# Altium project uAMDC.PrjPcb (part 3 of 3)
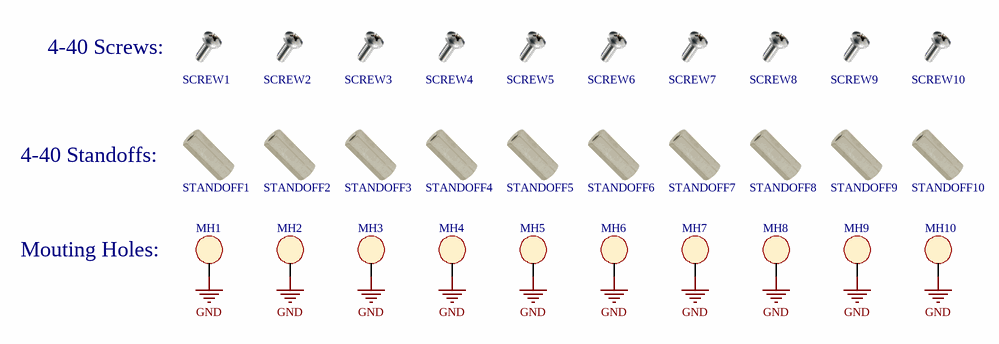
[diagram p26: BackPage.SchDoc]

## Nets that join several sheets
1.8V: USB_UART (6 pins), FPGA (10 pins), InverterTranslation (JP2.3 JP3.3 JP4.3 JP5.3), U_FPGA/U_DriveInterface/U_InverterTranslation/U_LVHV8ChanTranslation4 (C4A.2 U2A.1 U2A.2), U_FPGA/U_DriveInterface/U_InverterTranslation/U_LVHV8ChanTranslation5 (C4B.2 U2B.1 U2B.2), U_FPGA/U_DriveInterface/U_InverterTranslation/U_LVHV8ChanTranslation6 (C4C.2 U2C.1 U2C.2), U_FPGA/U_DriveInterface/U_InverterTranslation/U_TranslationStsA (C8C.1 U4C.1), U_FPGA/U_DriveInterface/U_InverterTranslation/U_TranslationStsB (C8D.1 U4D.1), U_FPGA/U_DriveInterface/U_InverterTranslation/U_TranslationStsC (C8E.1 U4E.1), U_FPGA/U_DriveInterface/U_InverterTranslation/U_TranslationStsD (C8F.1 U4F.1), AnalogADCs (R18.1), Encoder (C12.1 U6.23 U6.24), FPGA_IO (C106.1 U24.1 U24.5), Power (R75.1)
3.3V: DSP (33 pins), U_DSP/U_GPIO/isoSPI1_Interface (C96A.2 R47A.2 U20A.1 U20A.6), U_DSP/U_GPIO/U_TranslationSPI_A (C8A.1 U4A.1), U_DSP/U_GPIO/U_TranslationSPI_C (C8B.1 U4B.1 U4B.2), U_DSP/U_GPIO/isoSPI2_Interface (C96B.2 R47B.2 U20B.1 U20B.6), U_DSP/U_GPIO/isoSPI3_Interface (C96C.2 R47C.2 U20C.1 U20C.6), U_DSP/U_GPIO/isoSPI4_Interface (C96D.2 R47D.2 U20D.1 U20D.6), SWD (J1.1), Ethernet (8 pins), FPGA (10 pins), DriveInterface (JP1.1), FPGA_IO (R57.1 R58.1), Power (R74.1)
5.5V: Power (11 pins), Power_InrushLimit (U39.7 U39.8)
5V: GPIO (6 pins), U_DSP/U_GPIO/isoSPI1_Interface (C97A.2 U20A.9 U20A.12), U_DSP/U_GPIO/U_TranslationSPI_A (C7A.1 U4A.23 U4A.24), U_DSP/U_GPIO/U_TranslationSPI_C (C7B.1 U4B.23 U4B.24), U_DSP/U_GPIO/isoSPI2_Interface (C97B.2 U20B.9 U20B.12), U_DSP/U_GPIO/isoSPI3_Interface (C97C.2 U20C.9 U20C.12), U_DSP/U_GPIO/isoSPI4_Interface (C97D.2 U20D.9 U20D.12), USB_UART (U22.5), USB (U41.5), DriveInterface (JP1.3), U_FPGA/U_DriveInterface/U_InverterTranslation/U_LVHV8ChanTranslation4 (C1A.1 U2A.23 U2A.24), U_FPGA/U_DriveInterface/U_InverterTranslation/U_LVHV8ChanTranslation5 (C1B.1 U2B.23 U2B.24), U_FPGA/U_DriveInterface/U_InverterTranslation/U_LVHV8ChanTranslation6 (C1C.1 U2C.23 U2C.24), AnalogInterface (U13.1), AnalogADCs (R17.1), Encoder (9 pins), FPGA_IO (15 pins), Power (R66.1)
+12V: AnalogConnectors (CON5.3A CON5.3B CON5.3C CON5.3D), AnalogConditioning (R19.1 R22.1), Power (R73.1)
-12V: AnalogConnectors (CON5.5A CON5.5B CON5.5C CON5.5D), AnalogConditioning (R20.1 R23.1), Power (R77.1)
GND: DSP (33 pins), GPIO (11 pins), U_DSP/U_GPIO/isoSPI1_Interface (7 pins), U_DSP/U_GPIO/U_TranslationSPI_A (11 pins), U_DSP/U_GPIO/U_TranslationSPI_C (10 pins), U_DSP/U_GPIO/isoSPI2_Interface (7 pins), U_DSP/U_GPIO/isoSPI3_Interface (7 pins), U_DSP/U_GPIO/isoSPI4_Interface (7 pins), USB_UART (11 pins), SWD (J1.3 J1.5 J1.9), USB (6 pins), Ethernet (22 pins), FPGA (21 pins), DriveInterface (CON2.2), U_FPGA/U_DriveInterface/U_InverterConnectors/InverterConnector1AB (5 pins), U_FPGA/U_DriveInterface/U_InverterConnectors/InverterConnector2AB (5 pins), InverterTranslation (JP2.1 JP3.1 JP4.1 JP5.1), U_FPGA/U_DriveInterface/U_InverterTranslation/U_LVHV8ChanTranslation4 (14 pins), U_FPGA/U_DriveInterface/U_InverterTranslation/U_LVHV8ChanTranslation5 (14 pins), U_FPGA/U_DriveInterface/U_InverterTranslation/U_LVHV8ChanTranslation6 (14 pins), U_FPGA/U_DriveInterface/U_InverterTranslation/U_TranslationStsA (6 pins), U_FPGA/U_DriveInterface/U_InverterTranslation/U_TranslationStsB (6 pins), U_FPGA/U_DriveInterface/U_InverterTranslation/U_TranslationStsC (6 pins), U_FPGA/U_DriveInterface/U_InverterTranslation/U_TranslationStsD (6 pins), AnalogInterface (U13.3), AnalogADCs (37 pins), AnalogConnectors (25 pins), U_FPGA/U_AnalogInterface/U_AnalogConditioning/AnalogSigCond_A (8 pins), U_FPGA/U_AnalogInterface/U_AnalogConditioning/AnalogSigCond_B (8 pins), Encoder (21 pins), FPGA_IO (19 pins), Power (24 pins), Power_InrushLimit (C140.1 C141.1 U39.5 U39.9), BackPage (10 pins)
GND_IN: Power (C112.1 CON10.2 L2.2), Power_Protection (C142.2 C143.2 R82.2 U40.4)
GND_IN_PS: DriveInterface (CON1.2), U_FPGA/U_DriveInterface/U_InverterConnectors/InverterConnector1AB (CON3A.14A CON3A.14B), U_FPGA/U_DriveInterface/U_InverterConnectors/InverterConnector2AB (CON3B.14A CON3B.14B)
VDRIVE: DriveInterface (CON2.1), U_FPGA/U_DriveInterface/U_InverterTranslation/U_LVHV8ChanTranslation4 (8 pins), U_FPGA/U_DriveInterface/U_InverterTranslation/U_LVHV8ChanTranslation5 (8 pins), U_FPGA/U_DriveInterface/U_InverterTranslation/U_LVHV8ChanTranslation6 (8 pins)
VIN: Power (CON10.1), Power_Protection (6 pins)
VIN2: GPIO (CON9.6A CON9.6B), Power (7 pins)
VIN_ETH: Ethernet (7 pins), Power (R67.1)
VIN_FPGA: FPGA (11 pins), Power (R76.1)
VIN_PS: DriveInterface (CON1.1), InverterConnectors (R2.2 R4.2 R6.2 R8.2)
5.5VICL: Power (JP10.1), Power_InrushLimit (5 pins)
+12V: AnalogConditioning (R19.2), U_FPGA/U_AnalogInterface/U_AnalogConditioning/AnalogSigCond_A (C37A.2 C41A.2 U14A.11 U15A.11)
+12V: AnalogConditioning (R22.2), U_FPGA/U_AnalogInterface/U_AnalogConditioning/AnalogSigCond_B (C37B.2 C41B.2 U14B.11 U15B.11)
-12V: AnalogConditioning (R20.2), U_FPGA/U_AnalogInterface/U_AnalogConditioning/AnalogSigCond_A (C38A.1 C43A.1 U14A.4 U15A.4)
-12V: AnalogConditioning (R23.2), U_FPGA/U_AnalogInterface/U_AnalogConditioning/AnalogSigCond_B (C38B.1 C43B.1 U14B.4 U15B.4)
ADC_CLKOUT: FPGA (U16.138), AnalogADCs (TP3.1 U8.33)
ADC_CNV: FPGA (U16.144), AnalogADCs (TP1.1 U8.24)
ADC_IN1: AnalogADCs (U8.20), U_FPGA/U_AnalogInterface/U_AnalogConditioning/AnalogSigCond_A (C42A.1 R38A.1)
ADC_IN2: AnalogADCs (U8.17), U_FPGA/U_AnalogInterface/U_AnalogConditioning/AnalogSigCond_A (C40A.1 R37A.1)
ADC_IN3: AnalogADCs (U8.14), U_FPGA/U_AnalogInterface/U_AnalogConditioning/AnalogSigCond_B (C39B.1 R36B.1)
ADC_IN4: AnalogADCs (U8.11), U_FPGA/U_AnalogInterface/U_AnalogConditioning/AnalogSigCond_B (C36B.1 R35B.1)
ADC_IN5: AnalogADCs (U8.5), U_FPGA/U_AnalogInterface/U_AnalogConditioning/AnalogSigCond_B (C40B.1 R37B.1)
ADC_IN6: AnalogADCs (U8.2), U_FPGA/U_AnalogInterface/U_AnalogConditioning/AnalogSigCond_B (C42B.1 R38B.1)
ADC_IN7: AnalogADCs (U8.51), U_FPGA/U_AnalogInterface/U_AnalogConditioning/AnalogSigCond_A (C36A.1 R35A.1)
ADC_IN8: AnalogADCs (U8.48), U_FPGA/U_AnalogInterface/U_AnalogConditioning/AnalogSigCond_A (C39A.1 R36A.1)
ADC_SCK: FPGA (U16.130), AnalogADCs (TP2.1 U8.41)
ADC_SDO1: FPGA (U16.143), AnalogADCs (U8.27)
ADC_SDO2: FPGA (U16.142), AnalogADCs (U8.28)
ADC_SDO3: FPGA (U16.141), AnalogADCs (U8.29)
ADC_SDO4: FPGA (U16.139), AnalogADCs (U8.30)
ADC_SDO5: FPGA (U16.137), AnalogADCs (U8.35)
ADC_SDO6: FPGA (U16.136), AnalogADCs (U8.36)
ADC_SDO7: FPGA (U16.135), AnalogADCs (U8.39)
ADC_SDO8: FPGA (U16.134), AnalogADCs (U8.40)
ANLG_N1: AnalogConnectors (CON5.2A R25.1 U11.3), U_FPGA/U_AnalogInterface/U_AnalogConditioning/AnalogSigCond_A (U15A.10)
ANLG_N2: AnalogConnectors (CON5.8A R26.1 U9.2), U_FPGA/U_AnalogInterface/U_AnalogConditioning/AnalogSigCond_A (U15A.12)
ANLG_N3: AnalogConnectors (CON5.2B R27.1 U10.1), U_FPGA/U_AnalogInterface/U_AnalogConditioning/AnalogSigCond_B (U14B.10)
ANLG_N4: AnalogConnectors (CON5.8B R28.1 U12.2), U_FPGA/U_AnalogInterface/U_AnalogConditioning/AnalogSigCond_B (U14B.12)
ANLG_N5: AnalogConnectors (CON5.2C R29.1 U9.4), U_FPGA/U_AnalogInterface/U_AnalogConditioning/AnalogSigCond_B (U15B.12)
ANLG_N6: AnalogConnectors (CON5.8C R30.1 U11.2), U_FPGA/U_AnalogInterface/U_AnalogConditioning/AnalogSigCond_B (U15B.10)
ANLG_N7: AnalogConnectors (CON5.2D R31.1 U12.4), U_FPGA/U_AnalogInterface/U_AnalogConditioning/AnalogSigCond_A (U14A.12)
ANLG_N8: AnalogConnectors (CON5.8D R32.1 U10.3), U_FPGA/U_AnalogInterface/U_AnalogConditioning/AnalogSigCond_A (U14A.10)
ANLG_P1: AnalogConnectors (CON5.1A R25.2 U11.4), U_FPGA/U_AnalogInterface/U_AnalogConditioning/AnalogSigCond_A (U15A.8)
ANLG_P2: AnalogConnectors (CON5.7A R26.2 U9.1), U_FPGA/U_AnalogInterface/U_AnalogConditioning/AnalogSigCond_A (U15A.14)
ANLG_P3: AnalogConnectors (CON5.1B R27.2 U10.4), U_FPGA/U_AnalogInterface/U_AnalogConditioning/AnalogSigCond_B (U14B.8)
ANLG_P4: AnalogConnectors (CON5.7B R28.2 U12.1), U_FPGA/U_AnalogInterface/U_AnalogConditioning/AnalogSigCond_B (U14B.14)
ANLG_P5: AnalogConnectors (CON5.1C R29.2 U9.3), U_FPGA/U_AnalogInterface/U_AnalogConditioning/AnalogSigCond_B (U15B.14)
ANLG_P6: AnalogConnectors (CON5.7C R30.2 U11.1), U_FPGA/U_AnalogInterface/U_AnalogConditioning/AnalogSigCond_B (U15B.8)
ANLG_P7: AnalogConnectors (CON5.1D R31.2 U12.3), U_FPGA/U_AnalogInterface/U_AnalogConditioning/AnalogSigCond_A (U14A.14)
ANLG_P8: AnalogConnectors (CON5.7D R32.2 U10.2), U_FPGA/U_AnalogInterface/U_AnalogConditioning/AnalogSigCond_A (U14A.8)
CDONE: DSP (U17.66), FPGA (R39.2 U16.65), FPGA_IO (R59.2)
CONFIG_SPI5_MISO: DSP (U17.20), FPGA (U16.67)
CONFIG_SPI5_MOSI: DSP (U17.21), FPGA (U16.68)
CONFIG_SPI5_NSS: DSP (U17.18), FPGA (U16.71)
CONFIG_SPI5_SCK: DSP (U17.19), FPGA (U16.70)
CRESET_B: DSP (U17.67), FPGA (R40.2 R41.1 U16.66), FPGA_IO (C104.2 SW1.1)
DRIVE_EN: DSP (U17.65), U_FPGA/U_DriveInterface/U_InverterTranslation/U_LVHV8ChanTranslation4 (8 pins), U_FPGA/U_DriveInterface/U_InverterTranslation/U_LVHV8ChanTranslation5 (8 pins), U_FPGA/U_DriveInterface/U_InverterTranslation/U_LVHV8ChanTranslation6 (8 pins), FPGA_IO (5 pins)
ETH_MDC: DSP (U17.27), Ethernet (U43.13)
ETH_MDIO: DSP (U17.36), Ethernet (R97.1)
EXTRA_SPI6_MISO: DSP (U17.42), FPGA (U16.2)
EXTRA_SPI6_MOSI: DSP (U17.129), FPGA (U16.32)
EXTRA_SPI6_NSS: DSP (U17.93), FPGA (U16.16)
EXTRA_SPI6_SCK: DSP (U17.41), FPGA (U16.1)
FMC_A0: DSP (U17.10), FPGA (U16.24)
FMC_A1: DSP (U17.11), FPGA (U16.23)
FMC_A2: DSP (U17.12), FPGA (U16.22)
FMC_A3: DSP (U17.13), FPGA (U16.21)
FMC_A4: DSP (U17.14), FPGA (U16.20)
FMC_A5: DSP (U17.15), FPGA (U16.19)
FMC_A6: DSP (U17.50), FPGA (U16.3)
FMC_A7: DSP (U17.53), FPGA (U16.4)
FMC_D0: DSP (U17.85), FPGA (U16.11)
FMC_D1: DSP (U17.86), FPGA (U16.12)
FMC_D2: DSP (U17.114), FPGA (U16.25)
FMC_D3: DSP (U17.115), FPGA (U16.26)
FMC_D4: DSP (U17.58), FPGA (U16.7)
FMC_D5: DSP (U17.59), FPGA (U16.8)
FMC_D6: DSP (U17.60), FPGA (U16.9)
FMC_D7: DSP (U17.63), FPGA (U16.10)
FMC_NBL0: DSP (U17.141), FPGA (U16.33)
FMC_NBL1: DSP (U17.142), FPGA (U16.34)
FMC_NE1: DSP (U17.97), FPGA (U16.17)
FMC_NE2: DSP (U17.98), FPGA (U16.18)
FMC_NE3: DSP (U17.91), FPGA (U16.15)
FMC_NE4: DSP (U17.127), FPGA (U16.31)
FMC_NOE: DSP (U17.118), FPGA (U16.28)
FMC_NWE: DSP (U17.119), FPGA (U16.29)
FPGA_NRST: DSP (U17.64), FPGA (U16.128)
GPIO_IN1: GPIO (U45.5), U_DSP/U_GPIO/U_TranslationSPI_A (U4A.21)
GPIO_IN2: GPIO (U45.3), U_DSP/U_GPIO/U_TranslationSPI_A (U4A.20)
GPIO_IN3: GPIO (U45.13), U_DSP/U_GPIO/U_TranslationSPI_A (U4A.19)
GPIO_IN4: GPIO (U45.11), U_DSP/U_GPIO/U_TranslationSPI_A (U4A.18)
GPIO_OUT1: GPIO (U44.7), U_DSP/U_GPIO/U_TranslationSPI_C (U4B.21)
GPIO_OUT2: GPIO (U44.1), U_DSP/U_GPIO/U_TranslationSPI_C (U4B.20)
GPIO_OUT3: GPIO (U44.15), U_DSP/U_GPIO/U_TranslationSPI_C (U4B.19)
GPIO_OUT4: GPIO (U44.9), U_DSP/U_GPIO/U_TranslationSPI_C (U4B.18)
IM: GPIO (R103.2 T1.3), U_DSP/U_GPIO/isoSPI1_Interface (U20A.10)
IM: GPIO (R104.2 T1.8), U_DSP/U_GPIO/isoSPI2_Interface (U20B.10)
IM: GPIO (R105.2 T2.3), U_DSP/U_GPIO/isoSPI3_Interface (U20C.10)
IM: GPIO (R106.2 T2.8), U_DSP/U_GPIO/isoSPI4_Interface (U20D.10)
IN1: DSP (U17.76), U_DSP/U_GPIO/U_TranslationSPI_A (U4A.3)
IN2: DSP (U17.116), U_DSP/U_GPIO/U_TranslationSPI_A (U4A.4)
IN3: DSP (U17.78), U_DSP/U_GPIO/U_TranslationSPI_A (U4A.5)
IN4: DSP (U17.124), U_DSP/U_GPIO/U_TranslationSPI_A (U4A.6)
INV1_PWM1: U_FPGA/U_DriveInterface/U_InverterConnectors/InverterConnector1AB (CON3A.1A), U_FPGA/U_DriveInterface/U_InverterTranslation/U_LVHV8ChanTranslation5 (U1B.11)
INV1_PWM2: U_FPGA/U_DriveInterface/U_InverterConnectors/InverterConnector1AB (CON3A.2A), U_FPGA/U_DriveInterface/U_InverterTranslation/U_LVHV8ChanTranslation5 (U1B.12)
INV1_PWM3: U_FPGA/U_DriveInterface/U_InverterConnectors/InverterConnector1AB (CON3A.3A), U_FPGA/U_DriveInterface/U_InverterTranslation/U_LVHV8ChanTranslation5 (U1B.13)
INV1_PWM4: U_FPGA/U_DriveInterface/U_InverterConnectors/InverterConnector1AB (CON3A.4A), U_FPGA/U_DriveInterface/U_InverterTranslation/U_LVHV8ChanTranslation5 (U1B.14)
INV1_PWM5: U_FPGA/U_DriveInterface/U_InverterConnectors/InverterConnector1AB (CON3A.5A), U_FPGA/U_DriveInterface/U_InverterTranslation/U_LVHV8ChanTranslation6 (U3C.11)
INV1_PWM6: U_FPGA/U_DriveInterface/U_InverterConnectors/InverterConnector1AB (CON3A.6A), U_FPGA/U_DriveInterface/U_InverterTranslation/U_LVHV8ChanTranslation6 (U3C.12)
INV2_PWM1: U_FPGA/U_DriveInterface/U_InverterConnectors/InverterConnector1AB (CON3A.1B), U_FPGA/U_DriveInterface/U_InverterTranslation/U_LVHV8ChanTranslation6 (U1C.13)
INV2_PWM2: U_FPGA/U_DriveInterface/U_InverterConnectors/InverterConnector1AB (CON3A.2B), U_FPGA/U_DriveInterface/U_InverterTranslation/U_LVHV8ChanTranslation6 (U1C.12)
INV2_PWM3: U_FPGA/U_DriveInterface/U_InverterConnectors/InverterConnector1AB (CON3A.3B), U_FPGA/U_DriveInterface/U_InverterTranslation/U_LVHV8ChanTranslation6 (U1C.11)
INV2_PWM4: U_FPGA/U_DriveInterface/U_InverterConnectors/InverterConnector1AB (CON3A.4B), U_FPGA/U_DriveInterface/U_InverterTranslation/U_LVHV8ChanTranslation6 (U3C.14)
INV2_PWM5: U_FPGA/U_DriveInterface/U_InverterConnectors/InverterConnector1AB (CON3A.5B), U_FPGA/U_DriveInterface/U_InverterTranslation/U_LVHV8ChanTranslation6 (U3C.13)
INV2_PWM6: U_FPGA/U_DriveInterface/U_InverterConnectors/InverterConnector1AB (CON3A.6B), U_FPGA/U_DriveInterface/U_InverterTranslation/U_LVHV8ChanTranslation6 (U1C.14)
INV3_PWM1: U_FPGA/U_DriveInterface/U_InverterConnectors/InverterConnector2AB (CON3B.1A), U_FPGA/U_DriveInterface/U_InverterTranslation/U_LVHV8ChanTranslation4 (U3A.11)
INV3_PWM2: U_FPGA/U_DriveInterface/U_InverterConnectors/InverterConnector2AB (CON3B.2A), U_FPGA/U_DriveInterface/U_InverterTranslation/U_LVHV8ChanTranslation4 (U3A.12)
INV3_PWM3: U_FPGA/U_DriveInterface/U_InverterConnectors/InverterConnector2AB (CON3B.3A), U_FPGA/U_DriveInterface/U_InverterTranslation/U_LVHV8ChanTranslation4 (U3A.13)
INV3_PWM4: U_FPGA/U_DriveInterface/U_InverterConnectors/InverterConnector2AB (CON3B.4A), U_FPGA/U_DriveInterface/U_InverterTranslation/U_LVHV8ChanTranslation4 (U3A.14)
INV3_PWM5: U_FPGA/U_DriveInterface/U_InverterConnectors/InverterConnector2AB (CON3B.5A), U_FPGA/U_DriveInterface/U_InverterTranslation/U_LVHV8ChanTranslation4 (U1A.11)
INV3_PWM6: U_FPGA/U_DriveInterface/U_InverterConnectors/InverterConnector2AB (CON3B.6A), U_FPGA/U_DriveInterface/U_InverterTranslation/U_LVHV8ChanTranslation4 (U1A.12)
INV4_PWM1: U_FPGA/U_DriveInterface/U_InverterConnectors/InverterConnector2AB (CON3B.1B), U_FPGA/U_DriveInterface/U_InverterTranslation/U_LVHV8ChanTranslation5 (U3B.13)
INV4_PWM2: U_FPGA/U_DriveInterface/U_InverterConnectors/InverterConnector2AB (CON3B.2B), U_FPGA/U_DriveInterface/U_InverterTranslation/U_LVHV8ChanTranslation5 (U3B.12)
INV4_PWM3: U_FPGA/U_DriveInterface/U_InverterConnectors/InverterConnector2AB (CON3B.3B), U_FPGA/U_DriveInterface/U_InverterTranslation/U_LVHV8ChanTranslation5 (U3B.11)
INV4_PWM4: U_FPGA/U_DriveInterface/U_InverterConnectors/InverterConnector2AB (CON3B.4B), U_FPGA/U_DriveInterface/U_InverterTranslation/U_LVHV8ChanTranslation4 (U1A.14)
INV4_PWM5: U_FPGA/U_DriveInterface/U_InverterConnectors/InverterConnector2AB (CON3B.5B), U_FPGA/U_DriveInterface/U_InverterTranslation/U_LVHV8ChanTranslation4 (U1A.13)
INV4_PWM6: U_FPGA/U_DriveInterface/U_InverterConnectors/InverterConnector2AB (CON3B.6B), U_FPGA/U_DriveInterface/U_InverterTranslation/U_LVHV8ChanTranslation5 (U3B.14)
INV_STS_A1: U_FPGA/U_DriveInterface/U_InverterConnectors/InverterConnector1AB (CON3A.8A), U_FPGA/U_DriveInterface/U_InverterTranslation/U_TranslationStsA (U4C.21)
INV_STS_A2: U_FPGA/U_DriveInterface/U_InverterConnectors/InverterConnector1AB (CON3A.8B), U_FPGA/U_DriveInterface/U_InverterTranslation/U_TranslationStsA (U4C.20)
INV_STS_A3: U_FPGA/U_DriveInterface/U_InverterConnectors/InverterConnector2AB (CON3B.8A), U_FPGA/U_DriveInterface/U_InverterTranslation/U_TranslationStsA (U4C.19)
INV_STS_A4: U_FPGA/U_DriveInterface/U_InverterConnectors/InverterConnector2AB (CON3B.8B), U_FPGA/U_DriveInterface/U_InverterTranslation/U_TranslationStsA (U4C.18)
INV_STS_A_DIR: InverterTranslation (JP2.2), U_FPGA/U_DriveInterface/U_InverterTranslation/U_TranslationStsA (U4C.2)
INV_STS_B1: U_FPGA/U_DriveInterface/U_InverterConnectors/InverterConnector1AB (CON3A.9A), U_FPGA/U_DriveInterface/U_InverterTranslation/U_TranslationStsB (U4D.21)
INV_STS_B2: U_FPGA/U_DriveInterface/U_InverterConnectors/InverterConnector1AB (CON3A.9B), U_FPGA/U_DriveInterface/U_InverterTranslation/U_TranslationStsB (U4D.20)
INV_STS_B3: U_FPGA/U_DriveInterface/U_InverterConnectors/InverterConnector2AB (CON3B.9A), U_FPGA/U_DriveInterface/U_InverterTranslation/U_TranslationStsB (U4D.19)
INV_STS_B4: U_FPGA/U_DriveInterface/U_InverterConnectors/InverterConnector2AB (CON3B.9B), U_FPGA/U_DriveInterface/U_InverterTranslation/U_TranslationStsB (U4D.18)
INV_STS_B_DIR: InverterTranslation (JP3.2), U_FPGA/U_DriveInterface/U_InverterTranslation/U_TranslationStsB (U4D.2)
INV_STS_C1: U_FPGA/U_DriveInterface/U_InverterConnectors/InverterConnector1AB (CON3A.10A), U_FPGA/U_DriveInterface/U_InverterTranslation/U_TranslationStsC (U4E.21)
INV_STS_C2: U_FPGA/U_DriveInterface/U_InverterConnectors/InverterConnector1AB (CON3A.10B), U_FPGA/U_DriveInterface/U_InverterTranslation/U_TranslationStsC (U4E.20)
INV_STS_C3: U_FPGA/U_DriveInterface/U_InverterConnectors/InverterConnector2AB (CON3B.10A), U_FPGA/U_DriveInterface/U_InverterTranslation/U_TranslationStsC (U4E.19)
INV_STS_C4: U_FPGA/U_DriveInterface/U_InverterConnectors/InverterConnector2AB (CON3B.10B), U_FPGA/U_DriveInterface/U_InverterTranslation/U_TranslationStsC (U4E.18)
INV_STS_C_DIR: InverterTranslation (JP4.2), U_FPGA/U_DriveInterface/U_InverterTranslation/U_TranslationStsC (U4E.2)
INV_STS_D1: U_FPGA/U_DriveInterface/U_InverterConnectors/InverterConnector1AB (CON3A.11A), U_FPGA/U_DriveInterface/U_InverterTranslation/U_TranslationStsD (U4F.21)
INV_STS_D2: U_FPGA/U_DriveInterface/U_InverterConnectors/InverterConnector1AB (CON3A.11B), U_FPGA/U_DriveInterface/U_InverterTranslation/U_TranslationStsD (U4F.20)
INV_STS_D3: U_FPGA/U_DriveInterface/U_InverterConnectors/InverterConnector2AB (CON3B.11A), U_FPGA/U_DriveInterface/U_InverterTranslation/U_TranslationStsD (U4F.19)
INV_STS_D4: U_FPGA/U_DriveInterface/U_InverterConnectors/InverterConnector2AB (CON3B.11B), U_FPGA/U_DriveInterface/U_InverterTranslation/U_TranslationStsD (U4F.18)
INV_STS_D_DIR: InverterTranslation (JP5.2), U_FPGA/U_DriveInterface/U_InverterTranslation/U_TranslationStsD (U4F.2)
IP: GPIO (R103.1 T1.1), U_DSP/U_GPIO/isoSPI1_Interface (U20A.11)
IP: GPIO (R104.1 T1.6), U_DSP/U_GPIO/isoSPI2_Interface (U20B.11)
IP: GPIO (R105.1 T2.1), U_DSP/U_GPIO/isoSPI3_Interface (U20C.11)
IP: GPIO (R106.1 T2.6), U_DSP/U_GPIO/isoSPI4_Interface (U20D.11)
LV_ENC_1A: FPGA (U16.96), Encoder (U6.21)
LV_ENC_1B: FPGA (U16.95), Encoder (U6.20)
LV_ENC_1Z: FPGA (U16.91), Encoder (U6.19)
LV_ENC_2A: FPGA (U16.90), Encoder (U6.18)
LV_ENC_2B: FPGA (U16.88), Encoder (U6.17)
LV_ENC_2Z: FPGA (U16.87), Encoder (U6.16)
LV_INV1_PWM1: FPGA (U16.113), U_FPGA/U_DriveInterface/U_InverterTranslation/U_LVHV8ChanTranslation5 (U2B.6)
LV_INV1_PWM2: FPGA (U16.114), U_FPGA/U_DriveInterface/U_InverterTranslation/U_LVHV8ChanTranslation5 (U2B.5)
LV_INV1_PWM3: FPGA (U16.115), U_FPGA/U_DriveInterface/U_InverterTranslation/U_LVHV8ChanTranslation5 (U2B.4)
LV_INV1_PWM4: FPGA (U16.116), U_FPGA/U_DriveInterface/U_InverterTranslation/U_LVHV8ChanTranslation5 (U2B.3)
LV_INV1_PWM5: FPGA (U16.117), U_FPGA/U_DriveInterface/U_InverterTranslation/U_LVHV8ChanTranslation6 (U2C.10)
LV_INV1_PWM6: FPGA (U16.118), U_FPGA/U_DriveInterface/U_InverterTranslation/U_LVHV8ChanTranslation6 (U2C.9)
LV_INV2_PWM1: FPGA (U16.124), U_FPGA/U_DriveInterface/U_InverterTranslation/U_LVHV8ChanTranslation6 (U2C.4)
LV_INV2_PWM2: FPGA (U16.122), U_FPGA/U_DriveInterface/U_InverterTranslation/U_LVHV8ChanTranslation6 (U2C.5)
LV_INV2_PWM3: FPGA (U16.121), U_FPGA/U_DriveInterface/U_InverterTranslation/U_LVHV8ChanTranslation6 (U2C.6)
LV_INV2_PWM4: FPGA (U16.120), U_FPGA/U_DriveInterface/U_InverterTranslation/U_LVHV8ChanTranslation6 (U2C.7)
LV_INV2_PWM5: FPGA (U16.119), U_FPGA/U_DriveInterface/U_InverterTranslation/U_LVHV8ChanTranslation6 (U2C.8)
LV_INV2_PWM6: FPGA (U16.125), U_FPGA/U_DriveInterface/U_InverterTranslation/U_LVHV8ChanTranslation6 (U2C.3)
LV_INV3_PWM1: FPGA (U16.85), U_FPGA/U_DriveInterface/U_InverterTranslation/U_LVHV8ChanTranslation4 (U2A.10)
LV_INV3_PWM2: FPGA (U16.84), U_FPGA/U_DriveInterface/U_InverterTranslation/U_LVHV8ChanTranslation4 (U2A.9)
LV_INV3_PWM3: FPGA (U16.83), U_FPGA/U_DriveInterface/U_InverterTranslation/U_LVHV8ChanTranslation4 (U2A.8)
LV_INV3_PWM4: FPGA (U16.82), U_FPGA/U_DriveInterface/U_InverterTranslation/U_LVHV8ChanTranslation4 (U2A.7)
LV_INV3_PWM5: FPGA (U16.81), U_FPGA/U_DriveInterface/U_InverterTranslation/U_LVHV8ChanTranslation4 (U2A.6)
LV_INV3_PWM6: FPGA (U16.80), U_FPGA/U_DriveInterface/U_InverterTranslation/U_LVHV8ChanTranslation4 (U2A.5)
LV_INV4_PWM1: FPGA (U16.110), U_FPGA/U_DriveInterface/U_InverterTranslation/U_LVHV8ChanTranslation5 (U2B.8)
LV_INV4_PWM2: FPGA (U16.107), U_FPGA/U_DriveInterface/U_InverterTranslation/U_LVHV8ChanTranslation5 (U2B.9)
LV_INV4_PWM3: FPGA (U16.106), U_FPGA/U_DriveInterface/U_InverterTranslation/U_LVHV8ChanTranslation5 (U2B.10)
LV_INV4_PWM4: FPGA (U16.78), U_FPGA/U_DriveInterface/U_InverterTranslation/U_LVHV8ChanTranslation4 (U2A.3)
LV_INV4_PWM5: FPGA (U16.79), U_FPGA/U_DriveInterface/U_InverterTranslation/U_LVHV8ChanTranslation4 (U2A.4)
LV_INV4_PWM6: FPGA (U16.112), U_FPGA/U_DriveInterface/U_InverterTranslation/U_LVHV8ChanTranslation5 (U2B.7)
LV_INV_STS_A1: FPGA (U16.41), U_FPGA/U_DriveInterface/U_InverterTranslation/U_TranslationStsA (U4C.3)
LV_INV_STS_A2: FPGA (U16.39), U_FPGA/U_DriveInterface/U_InverterTranslation/U_TranslationStsA (U4C.4)
LV_INV_STS_A3: FPGA (U16.38), U_FPGA/U_DriveInterface/U_InverterTranslation/U_TranslationStsA (U4C.5)
LV_INV_STS_A4: FPGA (U16.37), U_FPGA/U_DriveInterface/U_InverterTranslation/U_TranslationStsA (U4C.6)
LV_INV_STS_B1: FPGA (U16.45), U_FPGA/U_DriveInterface/U_InverterTranslation/U_TranslationStsB (U4D.3)
LV_INV_STS_B2: FPGA (U16.44), U_FPGA/U_DriveInterface/U_InverterTranslation/U_TranslationStsB (U4D.4)
LV_INV_STS_B3: FPGA (U16.43), U_FPGA/U_DriveInterface/U_InverterTranslation/U_TranslationStsB (U4D.5)
LV_INV_STS_B4: FPGA (U16.42), U_FPGA/U_DriveInterface/U_InverterTranslation/U_TranslationStsB (U4D.6)
LV_INV_STS_C1: FPGA (U16.56), U_FPGA/U_DriveInterface/U_InverterTranslation/U_TranslationStsC (U4E.3)
LV_INV_STS_C2: FPGA (U16.55), U_FPGA/U_DriveInterface/U_InverterTranslation/U_TranslationStsC (U4E.4)
LV_INV_STS_C3: FPGA (U16.48), U_FPGA/U_DriveInterface/U_InverterTranslation/U_TranslationStsC (U4E.5)
LV_INV_STS_C4: FPGA (U16.47), U_FPGA/U_DriveInterface/U_InverterTranslation/U_TranslationStsC (U4E.6)
LV_INV_STS_D1: FPGA (U16.64), U_FPGA/U_DriveInterface/U_InverterTranslation/U_TranslationStsD (U4F.3)
LV_INV_STS_D2: FPGA (U16.63), U_FPGA/U_DriveInterface/U_InverterTranslation/U_TranslationStsD (U4F.4)
LV_INV_STS_D3: FPGA (U16.61), U_FPGA/U_DriveInterface/U_InverterTranslation/U_TranslationStsD (U4F.5)
LV_INV_STS_D4: FPGA (U16.60), U_FPGA/U_DriveInterface/U_InverterTranslation/U_TranslationStsD (U4F.6)
LV_RGB_LED: FPGA (U16.105), FPGA_IO (U24.3)
NetC112_2: Power (C112.2 L2.1), Power_Protection (C143.1 Q2.5 Q2.6 U40.7)
NetC144_1: DSP (R46.2), USB (5 pins)
NetCON3A_12A: InverterConnectors (R2.1), U_FPGA/U_DriveInterface/U_InverterConnectors/InverterConnector1AB (CON3A.12A)
NetCON3A_12B: InverterConnectors (R4.1), U_FPGA/U_DriveInterface/U_InverterConnectors/InverterConnector1AB (CON3A.12B)
NetCON3A_13A: InverterConnectors (R3.1), U_FPGA/U_DriveInterface/U_InverterConnectors/InverterConnector1AB (CON3A.13A)
NetCON3A_13B: InverterConnectors (R5.1), U_FPGA/U_DriveInterface/U_InverterConnectors/InverterConnector1AB (CON3A.13B)
NetCON3B_12A: InverterConnectors (R6.1), U_FPGA/U_DriveInterface/U_InverterConnectors/InverterConnector2AB (CON3B.12A)
NetCON3B_12B: InverterConnectors (R8.1), U_FPGA/U_DriveInterface/U_InverterConnectors/InverterConnector2AB (CON3B.12B)
NetCON3B_13A: InverterConnectors (R7.1), U_FPGA/U_DriveInterface/U_InverterConnectors/InverterConnector2AB (CON3B.13A)
NetCON3B_13B: InverterConnectors (R9.1), U_FPGA/U_DriveInterface/U_InverterConnectors/InverterConnector2AB (CON3B.13B)
NetR21_1: AnalogInterface (R34.1 U13.2), AnalogConditioning (R21.1 R24.1)
NRST: DSP (C70.1 U17.25), SWD (J1.10), Ethernet (U43.15)
OUT1: DSP (U17.75), U_DSP/U_GPIO/U_TranslationSPI_C (U4B.3)
OUT2: DSP (U17.113), U_DSP/U_GPIO/U_TranslationSPI_C (U4B.4)
OUT3: DSP (U17.69), U_DSP/U_GPIO/U_TranslationSPI_C (U4B.5)
OUT4: DSP (U17.96), U_DSP/U_GPIO/U_TranslationSPI_C (U4B.6)
RMII_CRS_DV: DSP (U17.43), Ethernet (R95.1)
RMII_REF_CLK: DSP (U17.35), Ethernet (R101.1)
RMII_RXD0: DSP (U17.44), Ethernet (R91.2)
RMII_RXD1: DSP (U17.45), Ethernet (R92.2)
RMII_TX_EN: DSP (U17.70), Ethernet (U43.16)
RMII_TXD0: DSP (U17.73), Ethernet (U43.17)
RMII_TXD1: DSP (U17.74), Ethernet (U43.18)
SPI1_MISO: DSP (U17.134), U_DSP/U_GPIO/isoSPI1_Interface (R47A.1 U20A.3)
SPI1_MOSI: DSP (U17.123), U_DSP/U_GPIO/isoSPI1_Interface (U20A.2)
SPI1_NSS: DSP (U17.125), U_DSP/U_GPIO/isoSPI1_Interface (U20A.5)
SPI1_SCLK: DSP (U17.126), U_DSP/U_GPIO/isoSPI1_Interface (U20A.4)
SPI2_MISO: DSP (U17.28), U_DSP/U_GPIO/isoSPI2_Interface (R47B.1 U20B.3)
SPI2_MOSI: DSP (U17.29), U_DSP/U_GPIO/isoSPI2_Interface (U20B.2)
SPI2_NSS: DSP (U17.140), U_DSP/U_GPIO/isoSPI2_Interface (U20B.5)
SPI2_SCLK: DSP (U17.117), U_DSP/U_GPIO/isoSPI2_Interface (U20B.4)
SPI3_MISO: DSP (U17.112), U_DSP/U_GPIO/isoSPI3_Interface (R47C.1 U20C.3)
SPI3_MOSI: DSP (U17.122), U_DSP/U_GPIO/isoSPI3_Interface (U20C.2)
SPI3_NSS: DSP (U17.110), U_DSP/U_GPIO/isoSPI3_Interface (U20C.5)
SPI3_SCLK: DSP (U17.111), U_DSP/U_GPIO/isoSPI3_Interface (U20C.4)
SPI4_MISO: DSP (U17.4), U_DSP/U_GPIO/isoSPI4_Interface (R47D.1 U20D.3)
SPI4_MOSI: DSP (U17.5), U_DSP/U_GPIO/isoSPI4_Interface (U20D.2)
SPI4_NSS: DSP (U17.3), U_DSP/U_GPIO/isoSPI4_Interface (U20D.5)
SPI4_SCLK: DSP (U17.1), U_DSP/U_GPIO/isoSPI4_Interface (U20D.4)
SWCLK: DSP (U17.109), SWD (J1.4)
SWDIO: DSP (U17.105), SWD (J1.2)
SWO: DSP (U17.133), SWD (J1.6)
USB_D_N: DSP (U17.103), USB (CON8.2 U41.3)
USB_D_P: DSP (U17.104), USB (CON8.3 U41.1)
USB_UART_RXD: DSP (U17.34), USB_UART (U21.20)
USB_UART_TXD: DSP (U17.139), USB_UART (U21.21)
VDDPS: DriveInterface (JP1.2), InverterConnectors (R3.2 R5.2 R7.2 R9.2), U_FPGA/U_DriveInterface/U_InverterTranslation/U_TranslationStsA (C7C.1 U4C.23 U4C.24), U_FPGA/U_DriveInterface/U_InverterTranslation/U_TranslationStsB (C7D.1 U4D.23 U4D.24), U_FPGA/U_DriveInterface/U_InverterTranslation/U_TranslationStsC (C7E.1 U4E.23 U4E.24), U_FPGA/U_DriveInterface/U_InverterTranslation/U_TranslationStsD (C7F.1 U4F.23 U4F.24)
VREF: AnalogInterface (R34.2), AnalogADCs (16 pins)
VREF: AnalogConditioning (R21.2), U_FPGA/U_AnalogInterface/U_AnalogConditioning/AnalogSigCond_A (U14A.3 U14A.5 U15A.3 U15A.5)
VREF: AnalogConditioning (R24.2), U_FPGA/U_AnalogInterface/U_AnalogConditioning/AnalogSigCond_B (U14B.3 U14B.5 U15B.3 U15B.5)